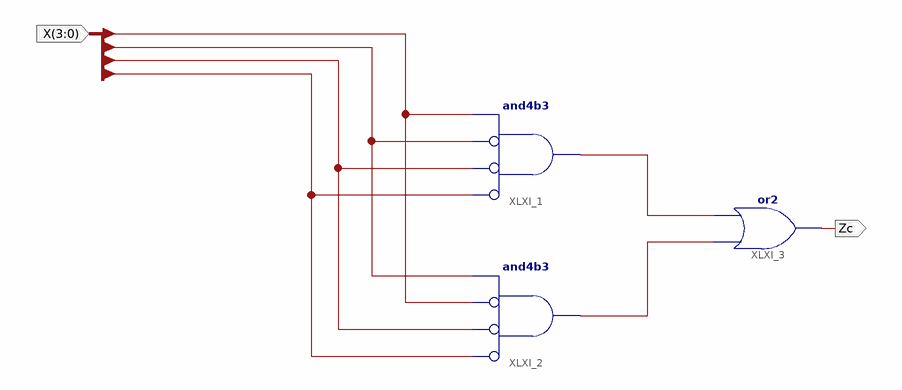
[diagram p0: schematic sheet 1]
// Xilinx ISE schematic c.sch (spartan3e) as structural Verilog: 3 symbols, 2 ports
module c (
  input  [3:0] X,
  output Zc
);

  wire XLXN_18, XLXN_19;

  and XLXI_1 (XLXN_18, ~X[3], ~X[2], ~X[1], X[0]);  // and4b3
  and XLXI_2 (XLXN_19, ~X[3], ~X[2], ~X[0], X[1]);  // and4b3
  or XLXI_3 (Zc, XLXN_19, XLXN_18);
endmodule
